# Altium schematic sheet Audio-Beamformer_Sensors_V1.0.SchDoc: Audio-Beamformer
size A4; PageSetup: Record=PageOptions|CenterHorizontal=True|CenterVertical=True|PrintScale=0.97|XCorrection=1.00|YCorrection=1.00|PrintKind=0|BorderSize=5000000|LeftOffset=0|BottomOffset=0|Orientation=2|PaperLength=1000|PaperWidth=1000|Scale=100|PaperSource=7|PrintQuality=-3|MediaType=1|DitherType=10|PrintScaleMode=1|PaperKind=A4|PaperIndex=9; Organization: Ostschweizer Fachhochschule; Address2: Florian Baumgartner & Thierry Schwaller; Address3: florian.baumgartner@ost.ch; DocumentNumber: 10; Revision: V1.0; SheetNumber: 10; SheetTotal: 10; Author: Florian Baumgartner & Thierry Schwaller; Subtitle: Sensors
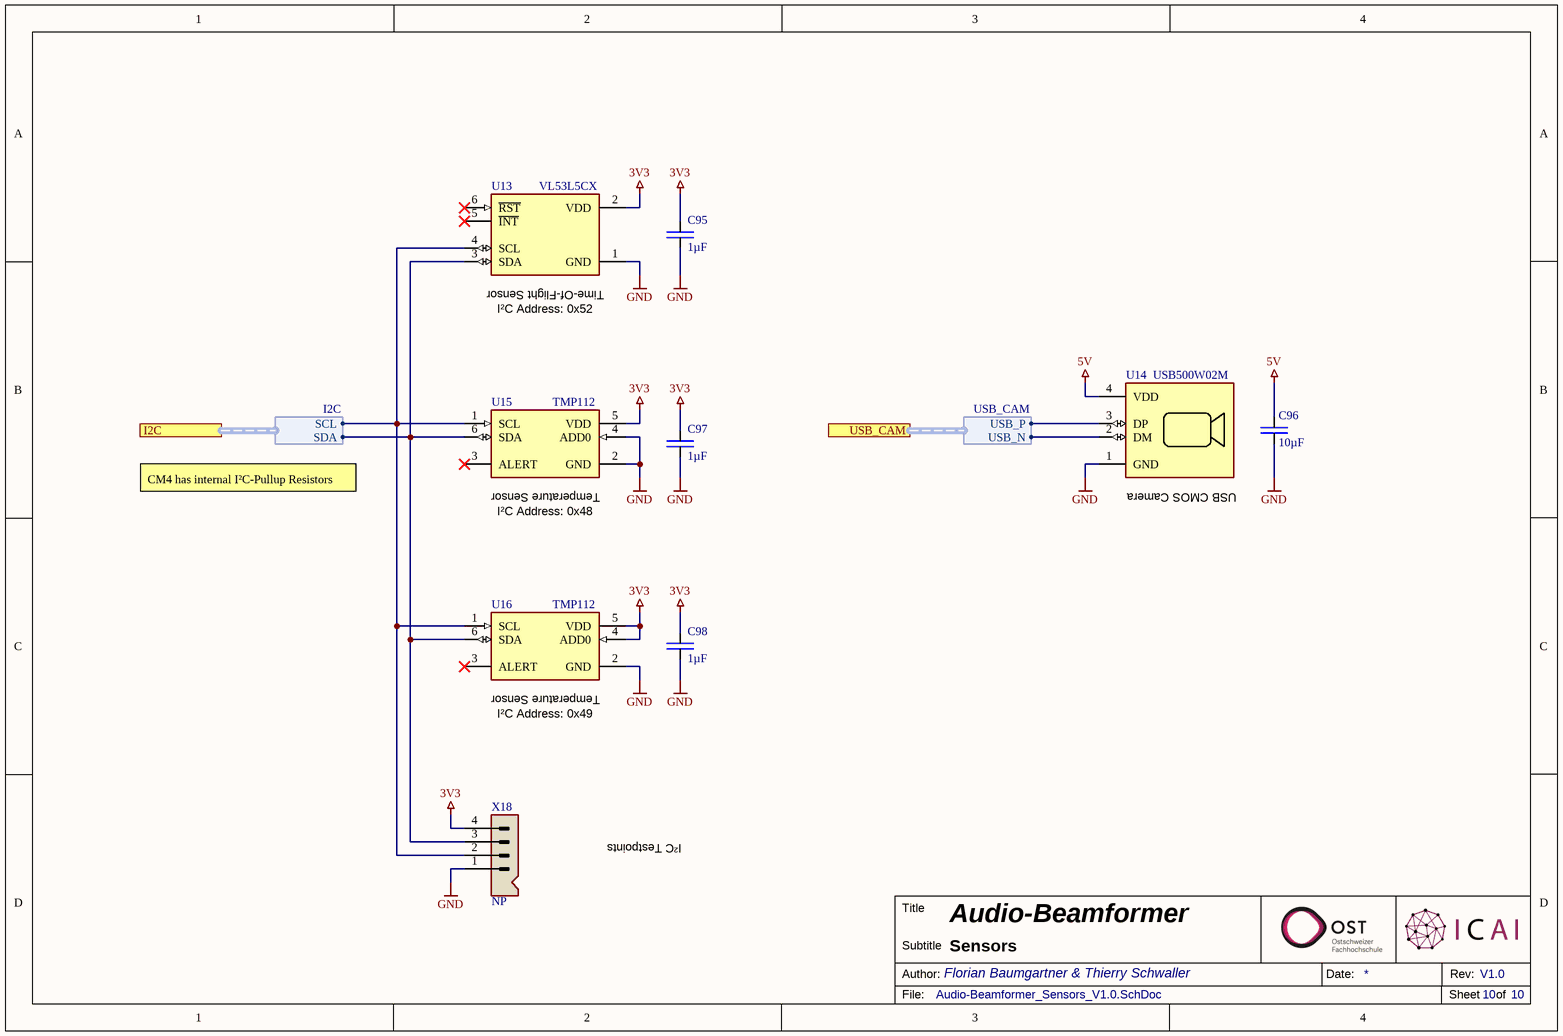
[diagram p0: Audio-Beamformer_Sensors_V1.0.SchDoc]

## Parts
C95  1µF  [SMD Keramikkondensator 0603]
C96  10µF  [SMD Keramikkondensator 1206]
C97  1µF  [SMD Keramikkondensator 0603]
C98  1µF  [SMD Keramikkondensator 0603]
U13  VL53L5CX  [THT ToF-Sensor (VL53L5CX)]
U14  USB500W02M  [THT Camera (USB500W02M)]
U15  TMP112  [SMD IC SOT-563]
U16  TMP112  [SMD IC SOT-563]
X18  NP  [THT Pin-Header 4x1 (NP)]

## Ports
I2C (harness I2C), USB_CAM (harness USB_CAM)

## Harnesses
I2C: SCL, SDA
USB_CAM: USB_N, USB_P

## Nets
3V3: C95.2 C97.2 C98.2 U13.2(VDD) U15.5(VDD) U16.4(ADD0) U16.5(VDD) X18.4
5V: C96.2 U14.4(VDD)
GND: C95.1 C96.1 C97.1 C98.1 U13.1(GND) U14.1(GND) U15.2(GND) U15.4(ADD0) U16.2(GND) X18.1
NetU13_3: U13.3(SDA) U15.6(SDA) U16.6(SDA) X18.3 ; port I2C.SDA
NetU13_4: U13.4(SCL) U15.1(SCL) U16.1(SCL) X18.2 ; port I2C.SCL
NetU14_2: U14.2(DM) ; port USB_CAM.USB_N
NetU14_3: U14.3(DP) ; port USB_CAM.USB_P

Not connected (* = marked no-connect by the designer): U13 5(~{INT})* 6(~{RST})*; U15 3(ALERT)*; U16 3(ALERT)*

## Notes on the sheet
- (near U13) Time-Of-Flight Sensor
- (near U13) I²C Address: 0x52
- CM4 has internal I²C-Pullup Resistors
- (near U15) Temperature Sensor
- (near U15) I²C Address: 0x48
- (near U14) USB CMOS Camera
- (near U16) Temperature Sensor
- (near U16) I²C Address: 0x49
- (near X18) I²C Testpoints
- Title
- Author:
- Subtitle
- Date:
- Rev:
- File:
- Sheet
- of

## Library data of the parts
C95 C97 C98 = C-CAPACITOR: CAP-MK; Component Description: Multilayer Ceramic Capacitors; Component Value: 1µF 16V; Digikey: 587-1251-1-ND; Farnell: 1327680; Mouser: 963-EMK107BJ105KA-T; JLC-Parts: C15849; Unit Price: 0.01
C96 = C-CAPACITOR: CAP-MK; Component Description: Multilayer Ceramic Capacitors; Component Value: 10µF 50V; Digikey: 445-7886-1-ND; Farnell: 2211092; Mouser: 810-CGA5L3X5R1H106K; JLC-Parts: C13585; Unit Price: 0.27
U13 = U-VL53L5CX: Time-of-Flight 8x8 Multizone Sensor; ComponentLink1Description: Datasheet; ComponentLink1URL: https://www.st.com/resource/en/datasheet/vl53l5cx.pdf; Digikey: 1568-SEN-19013-ND; Component Value: VL53L5CX; Mouser: 474-SEN-19013; Unit Price: 22.95; Component Description: Time-of-Flight 8x8 Multizone Sensor
U14 = U-USB500W02M: USB 5.0 Megapixel CMOS Camera Module; ComponentLink1Description: Datasheet; ComponentLink1URL: http://chinavasion.cn/upfile/2017/11/17/20171117105421_537.pdf; Component Description: USB 5.0 Megapixel CMOS Camera Module; Component Value: USB500W02M; Unit Price: 40.00
U15 U16 = U-TMP112AIDRLR: High-Accuracy, Low-Power, Digital Temperature Sensor; Digikey: 296-38578-1-ND; Farnell: 3009067; JLC-Parts: C28927; Mouser: 595-TMP112AIDRLR; ComponentLink1Description: Datasheet; ComponentLink1URL: https://www.ti.com/general/docs/suppproductinfo.tsp?distId=10&gotoUrl=https%3A%2F%2Fwww.ti.com%2Flit%2Fgpn%2Ftmp112; Component Description: High-Accuracy, Low-Power, Digital Temperature Sensor; Component Value: TMP112AIDRLR; Unit Price: 1.79
X18 = X-Stiftleiste (4-Fach): Component Description: Pin Header; Unit Price: 0.00